# EasyEDA schematic SCH_0404_2023-05-09.json
TITLE: Sheet_1; REV: 1.0; Date: 2023-04-04; Sheet: 1/1; Drawn By: yubinininin; Company: Your Company
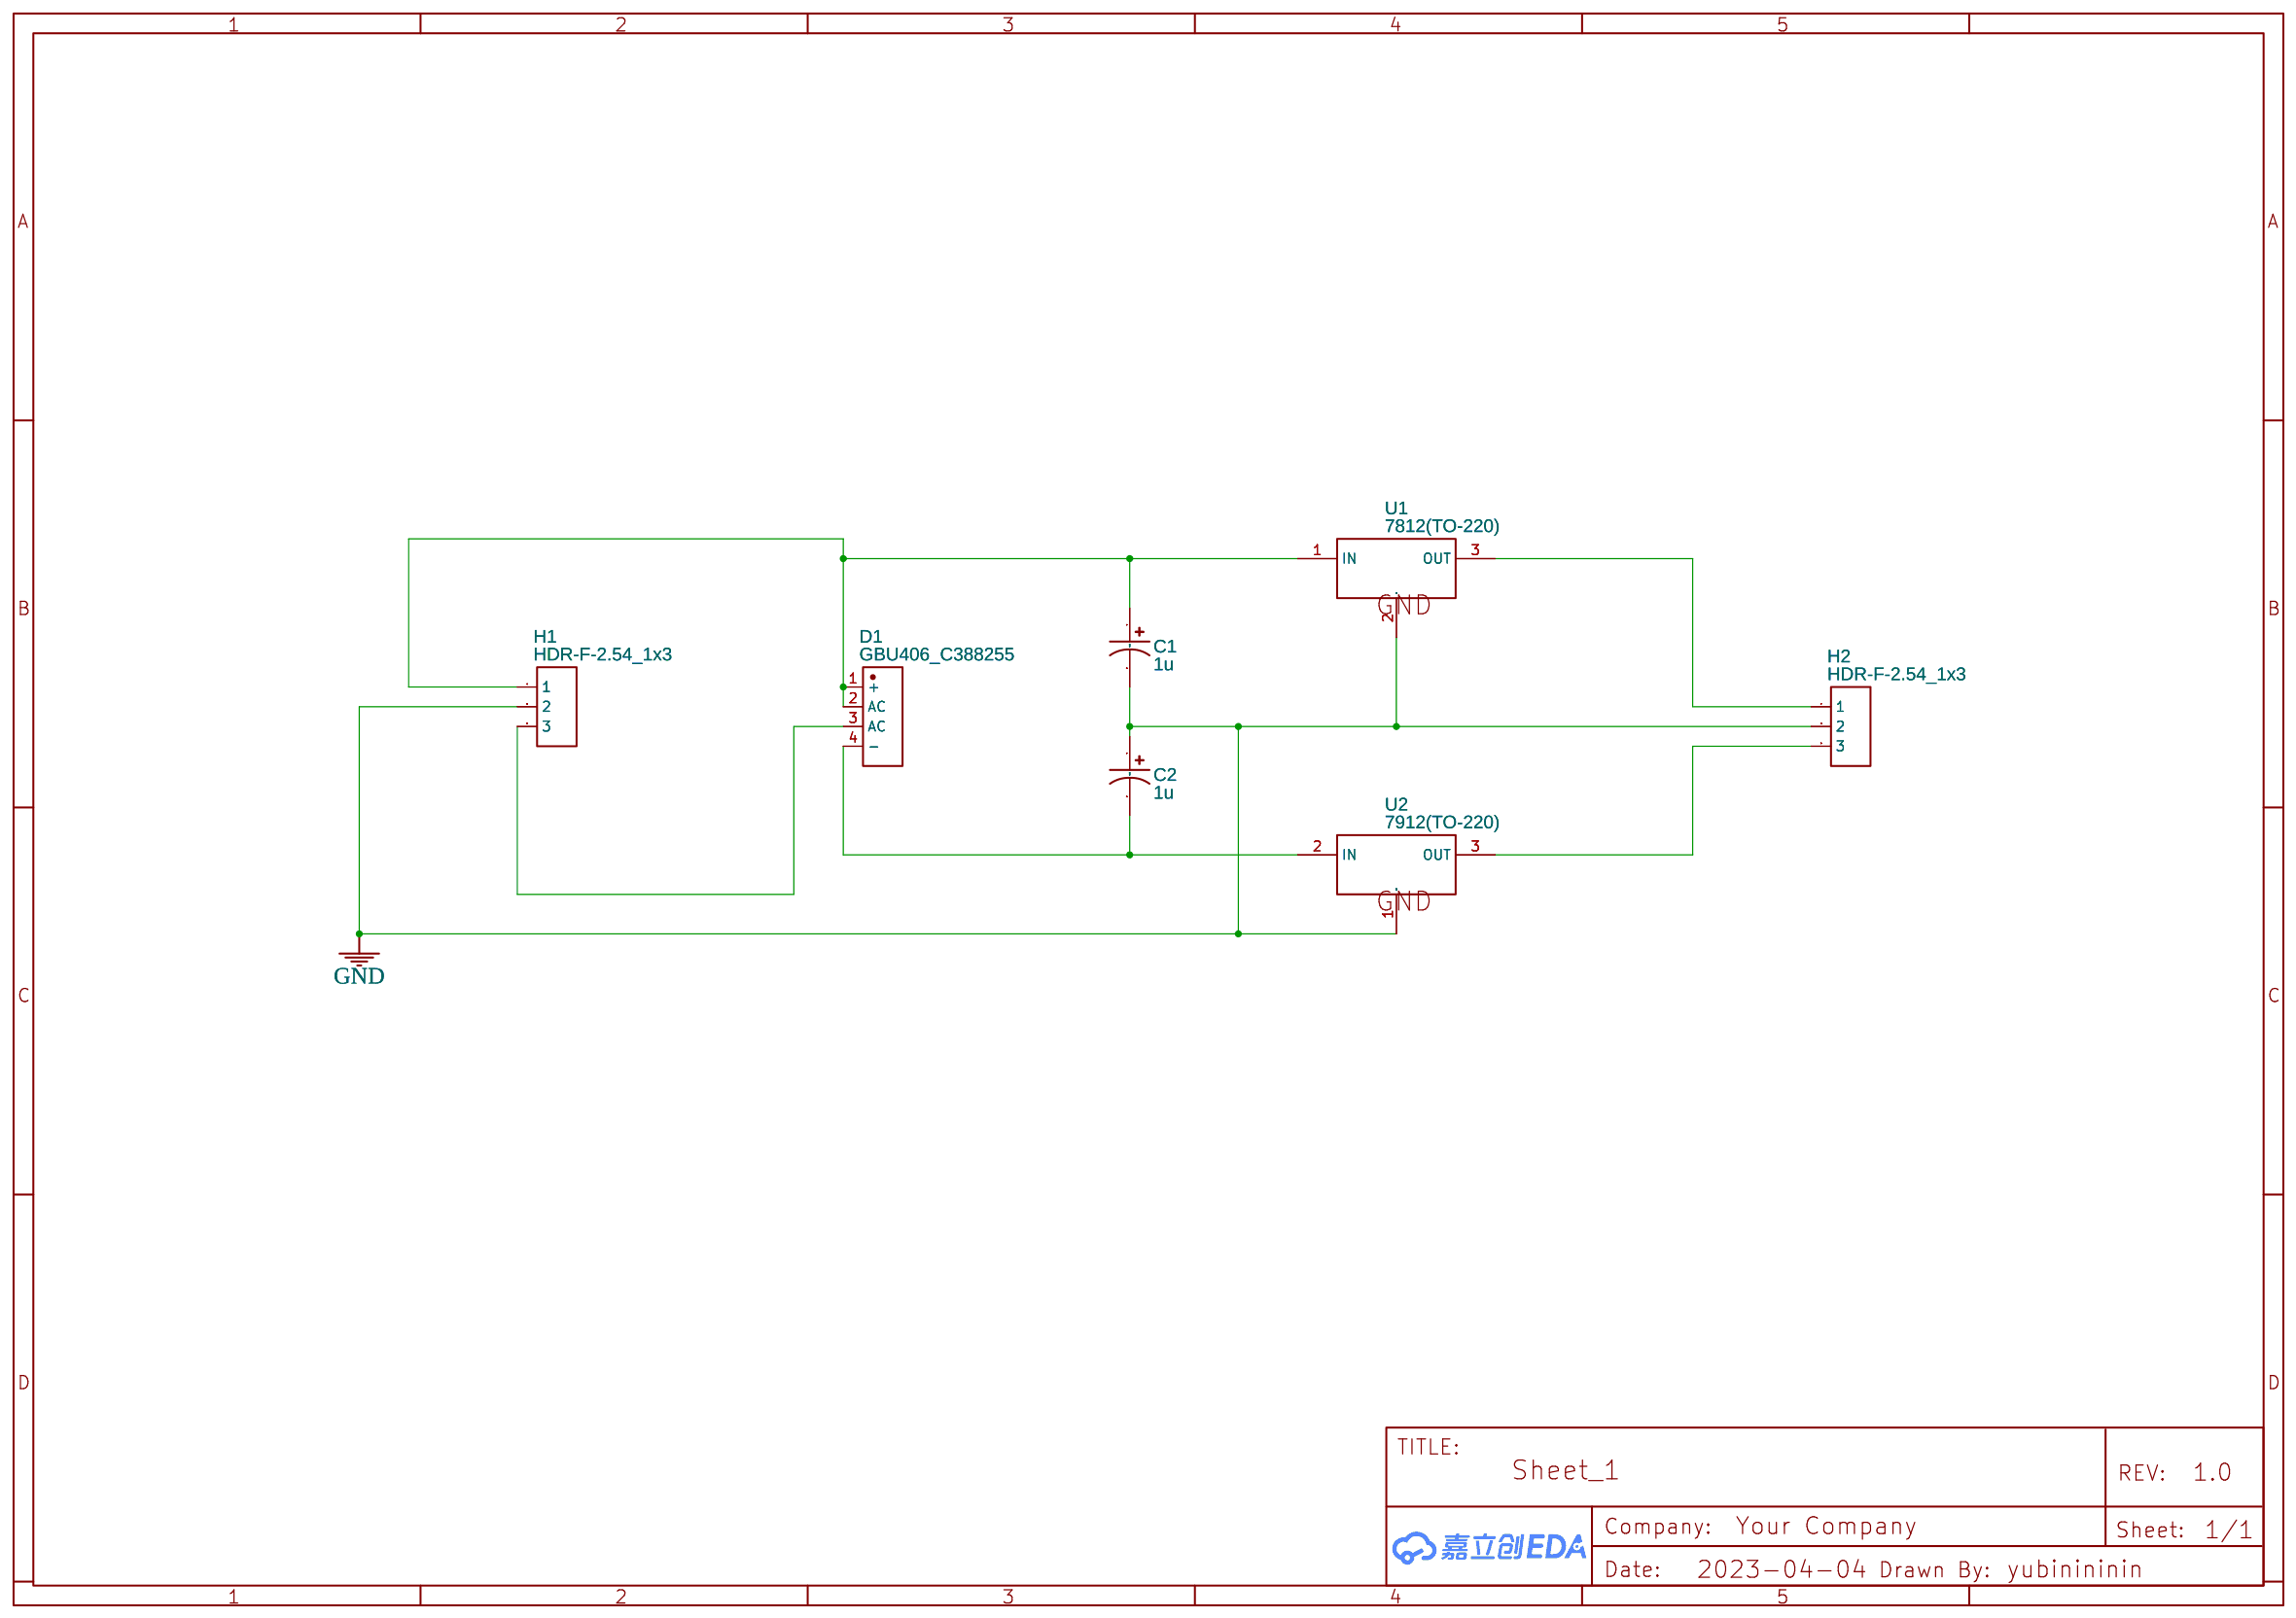
[diagram p0: schematic sheet]

## Parts
C1  1u  [CASE-A_3216]
C2  1u  [CASE-A_3216]
D1  GBU406_C388255  [DIO-BG-TH_GBU]
H1  HDR-F-2.54_1x3  [HDR-F-2.54_1X3]
H2  HDR-F-2.54_1x3  [HDR-F-2.54_1X3]
U1  7812(TO-220)  [TO-220-3_L10.0-W4.5-P2.54-L]
U2  7912(TO-220)  [TO-220-3_L10.0-W4.5-P2.54-L]

## Library data of the parts
C1 C2 = C_Tan_SMD_A_US: Contributor: LCEDA_Lib
D1 = GBU406_C388255: Supplier: LCSC; Supplier Part: C388255; Manufacturer: null; Manufacturer Part: GBU406; Contributor: LCSC; JLCPCB Part Class: Extended Part
H1 H2 = HDR-F-2.54_1x3: Supplier Part: C146690; Supplier: LCSC; Contributor: LCEDA_Lib
U1 = 7812(TO-220): Supplier: LCSC; Manufacturer: ON; Manufacturer Part: MC7812BTG; image: //image.lceda.cn/szlcsc/C45387.jpg; Supplier Part: C45387; Contributor: LCEDA_Lib
U2 = 7912(TO-220): Supplier: LCSC; Manufacturer: STMicroelectronics; Manufacturer Part: L7912CV-DG; image: //image.lceda.cn/szlcsc/C3797.jpg; Supplier Part: C3797; Contributor: LCEDA_Lib

## Nets
GND: C1.2 C2.1 H1.2 H2.2 U1.2(GND) U2.1(GND)
Net-(C1-1): C1.1 D1.1(+) D1.2(AC) H1.1 U1.1(IN)
Net-(C2-2): C2.2 D1.4(-) U2.2(IN)
Net-(D1-3): D1.3(AC) H1.3
Net-(H2-1): H2.1 U1.3(OUT)
Net-(H2-3): H2.3 U2.3(OUT)
